# Altium schematic sheet InverterConnectors.SchDoc: Inverter Connectors
size Letter; Engineer: Nathan Petersen; DocumentNumber: 16; Revision: v1.2; SheetNumber: 16; SheetTotal: 23
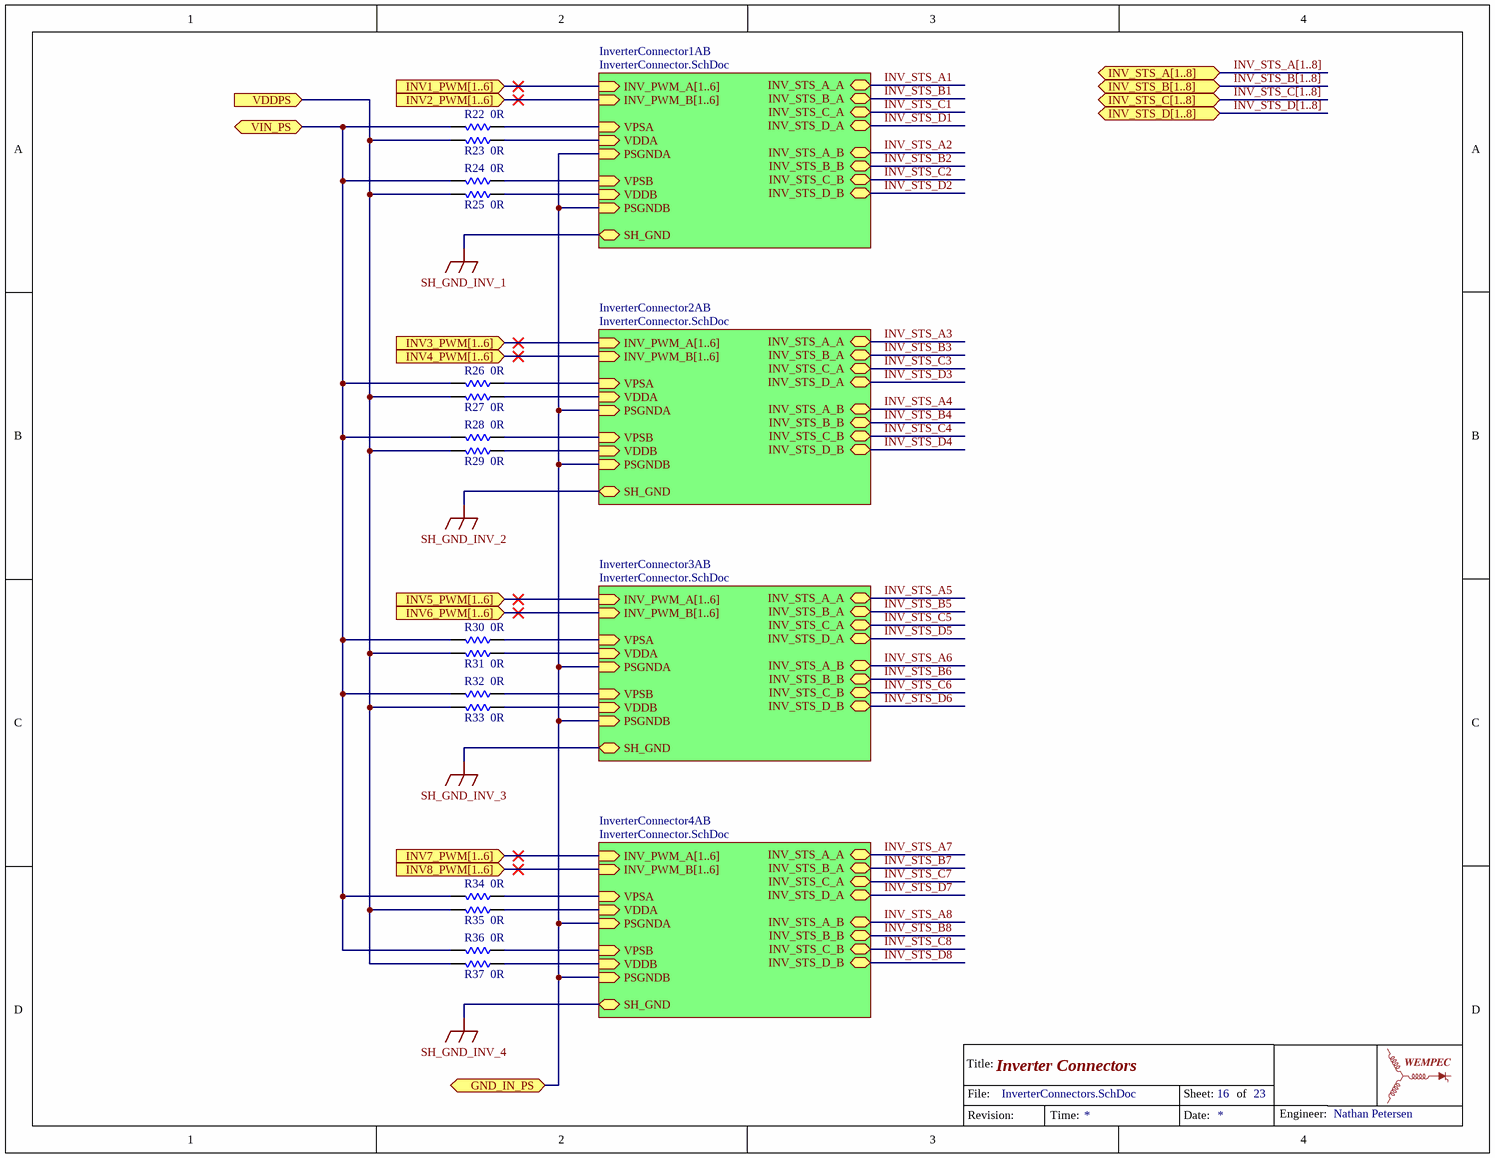
[diagram p0: InverterConnectors.SchDoc]

## Parts
R22  value 0R  [1206-RES]  (hidden comment: Resistor)
R23  value 0R  [1206-RES]  (hidden comment: Resistor)
R24  value 0R  [1206-RES]  (hidden comment: Resistor)
R25  value 0R  [1206-RES]  (hidden comment: Resistor)
R26  value 0R  [1206-RES]  (hidden comment: Resistor)
R27  value 0R  [1206-RES]  (hidden comment: Resistor)
R28  value 0R  [1206-RES]  (hidden comment: Resistor)
R29  value 0R  [1206-RES]  (hidden comment: Resistor)
R30  value 0R  [1206-RES]  (hidden comment: Resistor)
R31  value 0R  [1206-RES]  (hidden comment: Resistor)
R32  value 0R  [1206-RES]  (hidden comment: Resistor)
R33  value 0R  [1206-RES]  (hidden comment: Resistor)
R34  value 0R  [1206-RES]  (hidden comment: Resistor)
R35  value 0R  [1206-RES]  (hidden comment: Resistor)
R36  value 0R  [1206-RES]  (hidden comment: Resistor)
R37  value 0R  [1206-RES]  (hidden comment: Resistor)

## Sub-sheets
InverterConnector1AB = InverterConnector.SchDoc: INV_PWM_A[1..6] (in), INV_PWM_B[1..6] (in), SH_GND (bidir), INV_STS_A_B (bidir), INV_STS_A_A (bidir), INV_STS_B_A (bidir), INV_STS_C_A (bidir), INV_STS_D_A (bidir), INV_STS_B_B (bidir), INV_STS_C_B (bidir), INV_STS_D_B (bidir), VPSA (in), VDDA (in), PSGNDA (in), VPSB (in), VDDB (in), PSGNDB (in)
InverterConnector2AB = InverterConnector.SchDoc: INV_PWM_A[1..6] (in), INV_PWM_B[1..6] (in), SH_GND (bidir), INV_STS_A_B (bidir), INV_STS_A_A (bidir), INV_STS_B_A (bidir), INV_STS_C_A (bidir), INV_STS_D_A (bidir), INV_STS_B_B (bidir), INV_STS_C_B (bidir), INV_STS_D_B (bidir), VPSA (in), VDDA (in), PSGNDA (in), VPSB (in), VDDB (in), PSGNDB (in)
InverterConnector3AB = InverterConnector.SchDoc: INV_PWM_A[1..6] (in), INV_PWM_B[1..6] (in), SH_GND (bidir), INV_STS_A_B (bidir), INV_STS_A_A (bidir), INV_STS_B_A (bidir), INV_STS_C_A (bidir), INV_STS_D_A (bidir), INV_STS_B_B (bidir), INV_STS_C_B (bidir), INV_STS_D_B (bidir), VPSA (in), VDDA (in), PSGNDA (in), VPSB (in), VDDB (in), PSGNDB (in)
InverterConnector4AB = InverterConnector.SchDoc: INV_PWM_A[1..6] (in), INV_PWM_B[1..6] (in), SH_GND (bidir), INV_STS_A_B (bidir), INV_STS_A_A (bidir), INV_STS_B_A (bidir), INV_STS_C_A (bidir), INV_STS_D_A (bidir), INV_STS_B_B (bidir), INV_STS_C_B (bidir), INV_STS_D_B (bidir), VPSA (in), VDDA (in), PSGNDA (in), VPSB (in), VDDB (in), PSGNDB (in)

## Ports
GND_IN_PS (bidir), INV1_PWM[1..6] (in), INV2_PWM[1..6] (in), INV3_PWM[1..6] (in), INV4_PWM[1..6] (in), INV5_PWM[1..6] (in), INV6_PWM[1..6] (in), INV7_PWM[1..6] (in), INV8_PWM[1..6] (in), INV_STS_A[1..8] (bidir), INV_STS_B[1..8] (bidir), INV_STS_C[1..8] (bidir), INV_STS_D[1..8] (bidir), VDDPS (in), VIN_PS (bidir)

## Nets
SH_GND_INV_1: sheet InverterConnector1AB/SH_GND
SH_GND_INV_2: sheet InverterConnector2AB/SH_GND
SH_GND_INV_3: sheet InverterConnector3AB/SH_GND
SH_GND_INV_4: sheet InverterConnector4AB/SH_GND
GND_IN_PS: port GND_IN_PS, sheet InverterConnector1AB/PSGNDA, sheet InverterConnector1AB/PSGNDB, sheet InverterConnector2AB/PSGNDA, sheet InverterConnector2AB/PSGNDB, sheet InverterConnector3AB/PSGNDA, sheet InverterConnector3AB/PSGNDB, sheet InverterConnector4AB/PSGNDA, sheet InverterConnector4AB/PSGNDB
INV_STS_A1: sheet InverterConnector1AB/INV_STS_A_A
INV_STS_A2: sheet InverterConnector1AB/INV_STS_A_B
INV_STS_A3: sheet InverterConnector2AB/INV_STS_A_A
INV_STS_A4: sheet InverterConnector2AB/INV_STS_A_B
INV_STS_A5: sheet InverterConnector3AB/INV_STS_A_A
INV_STS_A6: sheet InverterConnector3AB/INV_STS_A_B
INV_STS_A7: sheet InverterConnector4AB/INV_STS_A_A
INV_STS_A8: sheet InverterConnector4AB/INV_STS_A_B
INV_STS_B1: sheet InverterConnector1AB/INV_STS_B_A
INV_STS_B2: sheet InverterConnector1AB/INV_STS_B_B
INV_STS_B3: sheet InverterConnector2AB/INV_STS_B_A
INV_STS_B4: sheet InverterConnector2AB/INV_STS_B_B
INV_STS_B5: sheet InverterConnector3AB/INV_STS_B_A
INV_STS_B6: sheet InverterConnector3AB/INV_STS_B_B
INV_STS_B7: sheet InverterConnector4AB/INV_STS_B_A
INV_STS_B8: sheet InverterConnector4AB/INV_STS_B_B
INV_STS_C1: sheet InverterConnector1AB/INV_STS_C_A
INV_STS_C2: sheet InverterConnector1AB/INV_STS_C_B
INV_STS_C3: sheet InverterConnector2AB/INV_STS_C_A
INV_STS_C4: sheet InverterConnector2AB/INV_STS_C_B
INV_STS_C5: sheet InverterConnector3AB/INV_STS_C_A
INV_STS_C6: sheet InverterConnector3AB/INV_STS_C_B
INV_STS_C7: sheet InverterConnector4AB/INV_STS_C_A
INV_STS_C8: sheet InverterConnector4AB/INV_STS_C_B
INV_STS_D1: sheet InverterConnector1AB/INV_STS_D_A
INV_STS_D2: sheet InverterConnector1AB/INV_STS_D_B
INV_STS_D3: sheet InverterConnector2AB/INV_STS_D_A
INV_STS_D4: sheet InverterConnector2AB/INV_STS_D_B
INV_STS_D5: sheet InverterConnector3AB/INV_STS_D_A
INV_STS_D6: sheet InverterConnector3AB/INV_STS_D_B
INV_STS_D7: sheet InverterConnector4AB/INV_STS_D_A
INV_STS_D8: sheet InverterConnector4AB/INV_STS_D_B
VDDPS: R23.2 R25.2 R27.2 R29.2 R31.2 R33.2 R35.2 R37.2 ; port VDDPS
VIN_PS: R22.2 R24.2 R26.2 R28.2 R30.2 R32.2 R34.2 R36.2 ; port VIN_PS
NetR22_1: R22.1 ; sheet InverterConnector1AB/VPSA
NetR23_1: R23.1 ; sheet InverterConnector1AB/VDDA
NetR24_1: R24.1 ; sheet InverterConnector1AB/VPSB
NetR25_1: R25.1 ; sheet InverterConnector1AB/VDDB
NetR26_1: R26.1 ; sheet InverterConnector2AB/VPSA
NetR27_1: R27.1 ; sheet InverterConnector2AB/VDDA
NetR28_1: R28.1 ; sheet InverterConnector2AB/VPSB
NetR29_1: R29.1 ; sheet InverterConnector2AB/VDDB
NetR30_1: R30.1 ; sheet InverterConnector3AB/VPSA
NetR31_1: R31.1 ; sheet InverterConnector3AB/VDDA
NetR32_1: R32.1 ; sheet InverterConnector3AB/VPSB
NetR33_1: R33.1 ; sheet InverterConnector3AB/VDDB
NetR34_1: R34.1 ; sheet InverterConnector4AB/VPSA
NetR35_1: R35.1 ; sheet InverterConnector4AB/VDDA
NetR36_1: R36.1 ; sheet InverterConnector4AB/VPSB
NetR37_1: R37.1 ; sheet InverterConnector4AB/VDDB

## Buses and harness runs
bus INV_STS_A[1..8] = port INV_STS_A[1..8]
bus INV_STS_B[1..8] = port INV_STS_B[1..8]
bus INV_STS_C[1..8] = port INV_STS_C[1..8]
bus INV_STS_D[1..8] = port INV_STS_D[1..8]
bus port INV1_PWM[1..6] = sheet InverterConnector1AB/INV_PWM_A[1..6]
bus port INV2_PWM[1..6] = sheet InverterConnector1AB/INV_PWM_B[1..6]
bus port INV3_PWM[1..6] = sheet InverterConnector2AB/INV_PWM_A[1..6]
bus port INV4_PWM[1..6] = sheet InverterConnector2AB/INV_PWM_B[1..6]
bus port INV5_PWM[1..6] = sheet InverterConnector3AB/INV_PWM_A[1..6]
bus port INV6_PWM[1..6] = sheet InverterConnector3AB/INV_PWM_B[1..6]
bus port INV7_PWM[1..6] = sheet InverterConnector4AB/INV_PWM_A[1..6]
bus port INV8_PWM[1..6] = sheet InverterConnector4AB/INV_PWM_B[1..6]

## Notes on the sheet
- Title:
- File:
- Sheet:
- of
- Revision:
- Time:
- Date:
- Engineer:

## Library data of the parts
R22-R37 = Resistor: Supplier 1: Digi-Key; Supplier Part Number 1: 311-0.0ERCT-ND